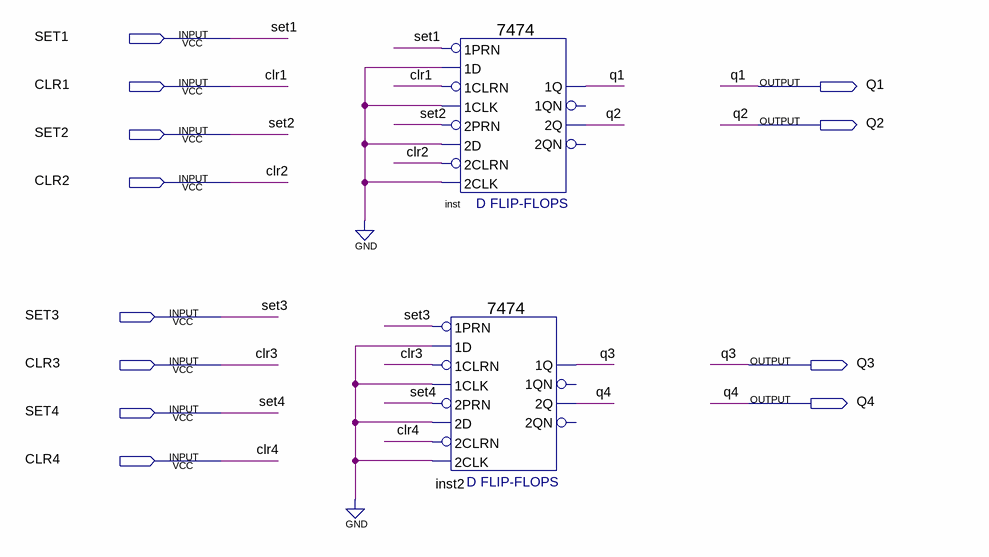
[diagram p0: schematic sheet]
// Quartus schematic clock.bdf as structural Verilog: 2 symbols, 12 pins
module clock (
  input  SET1,
  input  CLR1,
  input  SET2,
  input  CLR2,
  input  SET3,
  input  CLR3,
  input  SET4,
  input  CLR4,
  output Q1,
  output Q2,
  output Q3,
  output Q4
);

  \7474  inst (
    .\2D (1'b0), .\2PRN (SET2), .\1CLK (1'b0), .\1D (1'b0), .\1PRN (SET1), .\2CLK (1'b0), .\2CLRN (CLR2),
    .\1CLRN (CLR1), .\2Q (Q2), .\1Q (Q1));  // open: 1QN, 2QN
  \7474  inst2 (
    .\2D (1'b0), .\2PRN (SET4), .\1CLK (1'b0), .\1D (1'b0), .\1PRN (SET3), .\2CLK (1'b0), .\2CLRN (CLR4),
    .\1CLRN (CLR3), .\2Q (Q4), .\1Q (Q3));  // open: 1QN, 2QN
endmodule
